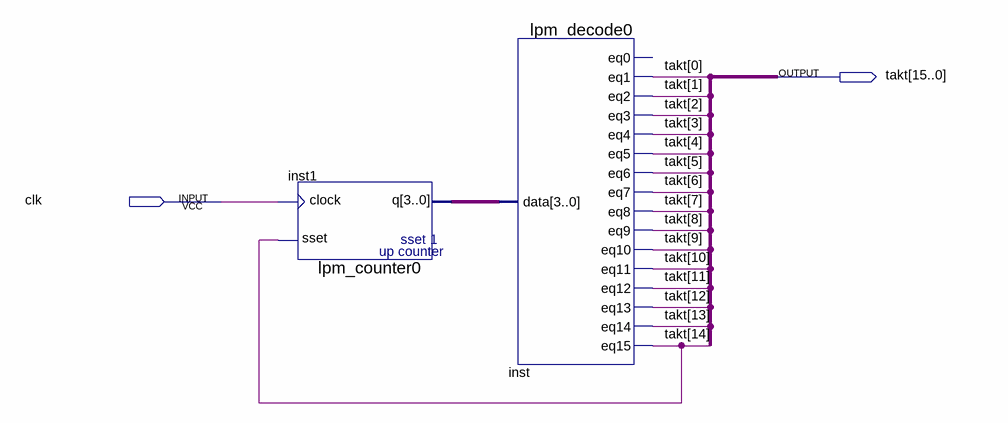
[diagram p0: schematic sheet]
// Quartus schematic TAKTS.bdf as structural Verilog: 2 symbols, 2 pins
module TAKTS (
  input  clk,
  output [15:0] takt
);

  wire [3:0] inst1_q;

  lpm_counter0 inst1 (.sset(takt[14]), .clock(clk), .q(inst1_q));
  lpm_decode0 inst (
    .data(inst1_q), .eq1(takt[0]), .eq2(takt[1]), .eq3(takt[2]), .eq4(takt[3]), .eq5(takt[4]), .eq6(takt[5]),
    .eq7(takt[6]), .eq8(takt[7]), .eq9(takt[8]), .eq10(takt[9]), .eq11(takt[10]), .eq12(takt[11]),
    .eq13(takt[12]), .eq14(takt[13]), .eq15(takt[14]));  // open: eq0
endmodule
